# EAGLE design CMoy-Pro-V_1_0_0A-digi_pot (EAGLE 6.4)

## Sheet 1 of 2
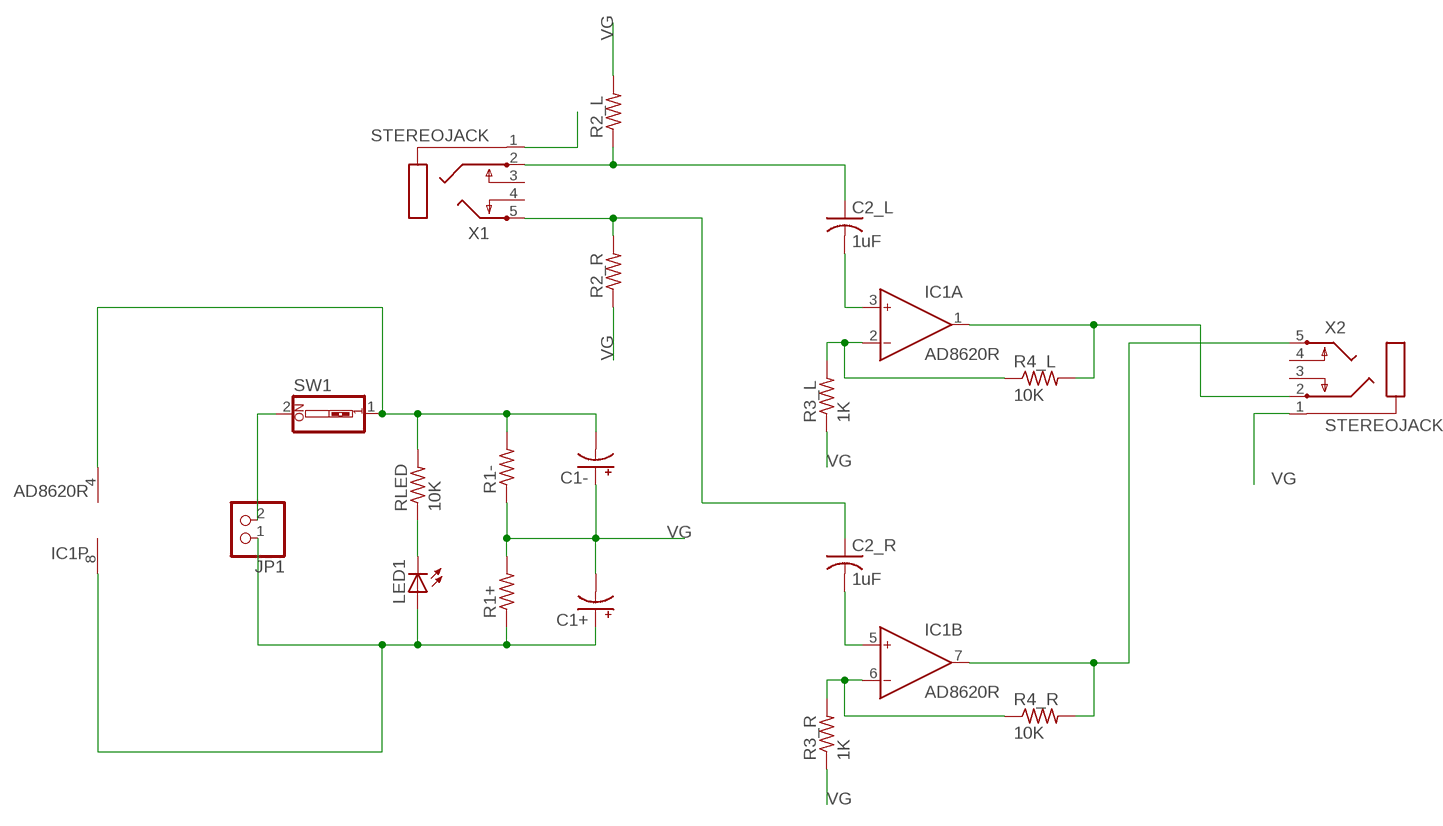
[diagram p0: schematic, sheet 1]

### Parts
C1+  CPOL-USE2.5-6  [E2,5-6]
C1-  CPOL-USE2.5-6  [E2,5-6]
C2_L  1uF  C-US102-043X133  [C102-043X133]
C2_R  1uF  C-US102-043X133  [C102-043X133]
IC1  AD8620R  [SO8]
JP1  PINHD-1X2  [1X02]
LED1  LEDCHIPLED_0805  [CHIPLED_0805]
R1+  R-US_R0805  [R0805]
R1-  R-US_R0805  [R0805]
R2_L  R-US_R0805  [R0805]
R2_R  R-US_R0805  [R0805]
R3_L  1K  R-US_R0805  [R0805]
R3_R  1K  R-US_R0805  [R0805]
R4_L  10K  R-US_R0805  [R0805]
R4_R  10K  R-US_R0805  [R0805]
RLED  10K  R-US_R0805  [R0805]
SW1  SW_DIP-1  [EDG-01]
X1  STEREOJACK  [STX3100]
X2  STEREOJACK  [STX3100]

### Nets
IN_L: C2_L.1 R2_L.1 X1.2
IN_R: C2_R.1 R2_R.2 X1.5
N$1: C2_L.2 IC1.3(A:IN+)
N$2: C2_R.2 IC1.5(B:IN+)
N$3: LED1.C RLED.1
N$5: IC1.2(A:IN-) R3_L.2 R4_L.1
N$6: IC1.6(B:IN-) R3_R.2 R4_R.1
OUT_L: IC1.1(A:OUT) R4_L.2 X2.2
OUT_R: IC1.7(B:OUT) R4_R.2 X2.5
V+: C1+.+ IC1.8(P:V+) JP1.1 LED1.A R1+.1
V-: JP1.2 SW1.2
V-_ON: C1-.- IC1.4(P:V-) R1-.2 RLED.2 SW1.1
VG: C1+.- C1-.+ R1+.2 R1-.1 R2_L.2 R2_R.1 R3_L.1 R3_R.1 X1.1 X2.1
Unconnected: X1.3 X1.4 X2.3 X2.4

## Sheet 2 of 2
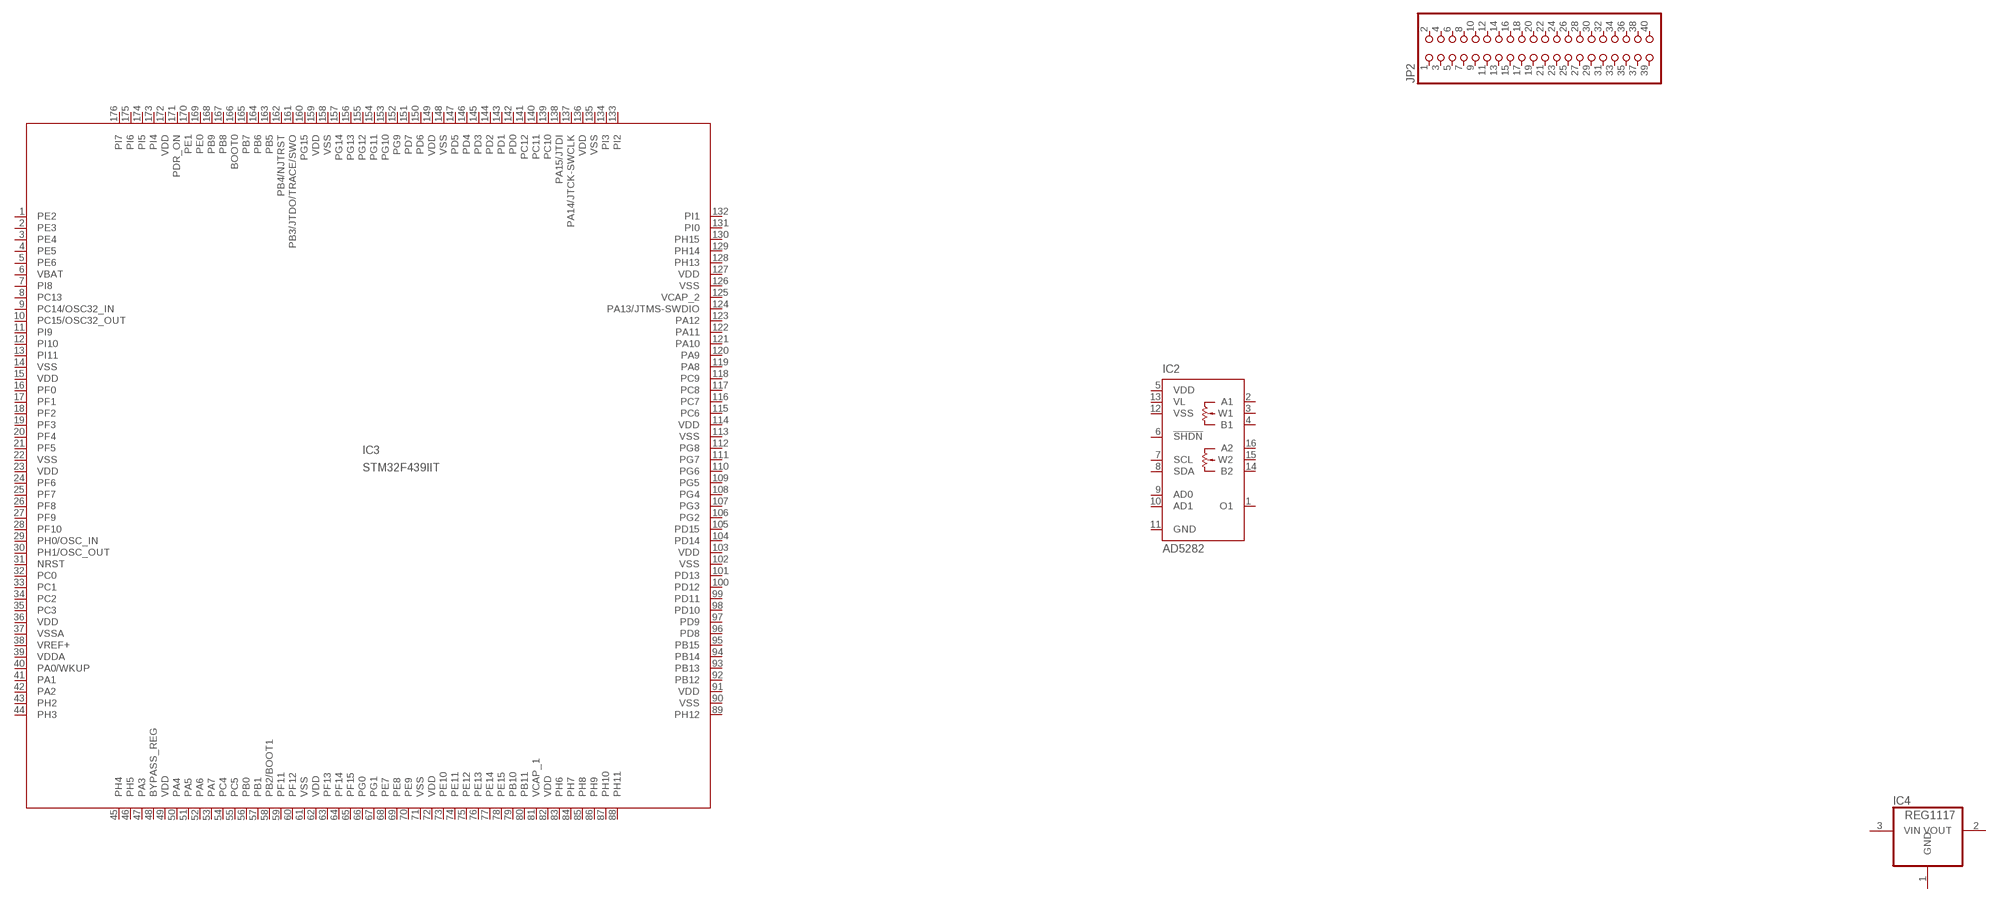
[diagram p1: schematic, sheet 2]

### Parts
IC2  AD5282  [TSSOP16]
IC3  STM32F439IIT  [LQFP-176]
IC4  REG1117  [SOT223]
JP2  PINHD-2X20  [2X20]
Unconnected: IC2.1(O1) IC2.2(A1) IC2.3(W1) IC2.4(B1) IC2.6(!SHDN) IC2.7(SCL) IC2.8(SDA) IC2.9(AD0) IC2.10(AD1) IC2.14(B2) IC2.15(W2) IC2.16(A2) IC3.1(PE2) IC3.2(PE3) IC3.3(PE4) IC3.4(PE5) IC3.5(PE6) IC3.7(PI8) IC3.8(PC13) IC3.9(PC14/OSC32_IN) IC3.10(PC15/OSC32_OUT) IC3.11(PI9) IC3.12(PI10) IC3.13(PI11) IC3.16(PF0) IC3.17(PF1) IC3.18(PF2) IC3.19(PF3) IC3.20(PF4) IC3.21(PF5) IC3.24(PF6) IC3.25(PF7) IC3.26(PF8) IC3.27(PF9) IC3.28(PF10) IC3.29(PH0/OSC_IN) IC3.30(PH1/OSC_OUT) IC3.31(NRST) IC3.32(PC0) IC3.33(PC1) IC3.34(PC2) IC3.35(PC3) IC3.40(PA0/WKUP) IC3.41(PA1) IC3.42(PA2) IC3.43(PH2) IC3.44(PH3) IC3.45(PH4) IC3.46(PH5) IC3.47(PA3) IC3.48(BYPASS_REG) IC3.50(PA4) IC3.51(PA5) IC3.52(PA6) IC3.53(PA7) IC3.54(PC4) IC3.55(PC5) IC3.56(PB0) IC3.57(PB1) IC3.58(PB2/BOOT1) IC3.59(PF11) IC3.60(PF12) IC3.62(VDD) IC3.63(PF13) IC3.64(PF14) IC3.65(PF15) IC3.66(PG0) IC3.67(PG1) IC3.68(PE7) IC3.69(PE8) IC3.70(PE9) IC3.73(PE10) IC3.74(PE11) IC3.75(PE12) IC3.76(PE13) IC3.77(PE14) IC3.78(PE15) IC3.79(PB10) IC3.80(PB11) IC3.83(PH6) IC3.84(PH7) IC3.85(PH8) IC3.86(PH9) IC3.87(PH10) IC3.88(PH11) IC3.89(PH12) IC3.92(PB12) IC3.93(PB13) IC3.94(PB14) IC3.95(PB15) IC3.96(PD8) IC3.97(PD9) IC3.98(PD10) IC3.99(PD11) IC3.100(PD12) IC3.101(PD13) IC3.104(PD14) IC3.105(PD15) IC3.106(PG2) IC3.107(PG3) IC3.108(PG4) IC3.109(PG5) IC3.110(PG6) IC3.111(PG7) IC3.112(PG8) IC3.115(PC6) IC3.116(PC7) IC3.117(PC8) IC3.118(PC9) IC3.119(PA8) IC3.120(PA9) IC3.121(PA10) IC3.122(PA11) IC3.123(PA12) IC3.124(PA13/JTMS-SWDIO) IC3.128(PH13) IC3.129(PH14) IC3.130(PH15) IC3.131(PI0) IC3.132(PI1) IC3.133(PI2) IC3.134(PI3) IC3.137(PA14/JTCK-SWCLK) IC3.138(PA15/JTDI) IC3.139(PC10) IC3.140(PC11) IC3.141(PC12) IC3.142(PD0) IC3.143(PD1) IC3.144(PD2) IC3.145(PD3) IC3.146(PD4) IC3.147(PD5) IC3.150(PD6) IC3.151(PD7) IC3.152(PG9) IC3.153(PG10) IC3.154(PG11) IC3.155(PG12) IC3.156(PG13) IC3.157(PG14) IC3.160(PG15) IC3.161(PB3/JTDO/TRACE/SWO) IC3.162(PB4/NJTRST) IC3.163(PB5) IC3.164(PB6) IC3.165(PB7) IC3.166(BOOT0) IC3.167(PB8) IC3.168(PB9) IC3.169(PE0) IC3.170(PE1) IC3.173(PI4) IC3.174(PI5) IC3.175(PI6) IC3.176(PI7) IC4.2(VOUT) IC4.3(VIN) JP2.1 JP2.2 JP2.3 JP2.4 JP2.5 JP2.6 JP2.7 JP2.8 JP2.9 JP2.10 JP2.11 JP2.12 JP2.13 JP2.14 JP2.15 JP2.16 JP2.17 JP2.18 JP2.19 JP2.20 JP2.21 JP2.22 JP2.23 JP2.24 JP2.25 JP2.26 JP2.27 JP2.28 JP2.29 JP2.30 JP2.31 JP2.32 JP2.33 JP2.34 JP2.35 JP2.36 JP2.37 JP2.38 JP2.39 JP2.40

## Power pins joined to a net without a drawn wire
GND: IC2.11(GND) IC4.1(GND)
PDR_ON: IC3.171(PDR_ON)
VBAT: IC3.6(VBAT)
VCAP_1: IC3.81(VCAP_1)
VCAP_2: IC3.125(VCAP_2)
VDD: IC2.5(VDD) IC3.15(VDD) IC3.23(VDD) IC3.36(VDD) IC3.49(VDD) IC3.72(VDD) IC3.82(VDD) IC3.91(VDD) IC3.103(VDD) IC3.114(VDD) IC3.127(VDD) IC3.136(VDD) IC3.149(VDD) IC3.159(VDD) IC3.172(VDD)
VDDA: IC3.39(VDDA)
VL: IC2.13(VL)
VREF+: IC3.38(VREF+)
VSS: IC2.12(VSS) IC3.14(VSS) IC3.22(VSS) IC3.61(VSS) IC3.71(VSS) IC3.90(VSS) IC3.102(VSS) IC3.113(VSS) IC3.126(VSS) IC3.135(VSS) IC3.148(VSS) IC3.158(VSS)
VSSA: IC3.37(VSSA)

## Library data of the parts
C1+ C1- = rcl:CPOL-US: POLARIZED CAPACITOR, American symbol
C2_L C2_R = rcl:C-US: CAPACITOR, American symbol
IC1 = analog-devices:AD8620: Precision, Very Low Noise, Low Input Bias Current, Wide Bandwidth JFET Operational Amplifiers Source: http://www.analog.com/static/imported-files/data_sheets/AD8610_8620.pdf; MF: ALTERA CORPORATION; MPN: AD8620ARZ; OC_FARNELL: 9994386; OC_NEWARK: 59K6972
IC2 = analog-devices:AD5282: Dual +15 V/±5 V, 256-Position, I2C-Compatible Digital Potentiometer Source: http://www.analog.com/static/imported-files/data_sheets/AD5280_5282.pdf; MF: ALTERA CORPORATION; MPN: AD5282BRUZ50; OC_FARNELL: 1438442; OC_NEWARK: 59K3850
IC3 = STM32F439IIT:STM32F439IIT: edit this description Auto generated by make-symbol-device-package-bsdl.ulp Rev. 43 Source:
IC4 = burr-brown:REG1117: 800mA and 1A Low Dropout (LDO) Positive Regulator 1.8V, 2.5V, 2.85V, 3.3V, 5V, and Adj; MPN: REG1117; OC_FARNELL: 1097566; OC_NEWARK: 14P6981
JP1 = pinhead:PINHD-1X2: PIN HEADER
JP2 = pinhead:PINHD-2X20: PIN HEADER
LED1 = adafruit:LED: LED OSRAM: - CHIPLED LG R971, LG N971, LY N971, LG Q971, LY Q971, LO R971, LY R971 LH N974, LH R974 LS Q976, LO Q976, LY Q976 LO Q996 - Hyper CHIPLED LW Q18S LB Q993, LB Q99A, LB R99A - SideLED LS A670, LO A670, LY A670, LG A670, LP A670 LB A673, LV A673, LT A673, LW A673 LH A674 LY A675 LS A676, LA A676, LO A676, LY A676, LW A676 LS A679, LY A679, LG A679 - Hyper Micro SIDELED® LS Y876, LA Y876, LO Y876, LY Y876 LT Y87S - SmartLED LW L88C, LW L88S LB L89C, LB L89S, LG L890 LS L89K, LO L89K, LY L89K LS L896, LA L896, LO L896, LY L896 - TOPLED LS T670, LO T670, LY T670, LG T670, LP T670 LSG T670, LSP T670, LSY T670, LOP T670, LYG T670 LG T671, LOG T671, LSG T671 LB T673, LV T673, LT T673, LW T673 LH T674 LS T676, LA T676, LO T676, LY T676, LB T676, LH T676, LSB T676, LW T676 LB T67C, LV T67C, LT T67C, LS T67K, LO T67K, LY T67K, LW E67C LS E67B, LA E67B, LO E67B, LY E67B, LB E67C, LV E67C, LT E67C LW T67C LS T679, LY T679, LG T679 LS T770, LO T770, LY T770, LG T770, LP T770 LB T773, LV T773, LT T773, LW T773 LH T774 LS E675, LA E675, LY E675, LS T675 LS T776, LA T776, LO T776, LY T776, LB T776 LHGB T686 LT T68C, LB T68C - Hyper Mini TOPLED® LB M676 - Mini TOPLED Santana® LG M470 LS M47K, LO M47K, LY M47K Source: http://www.osram.convergy.de/
R1+ R1- R2_L R2_R R3_L R3_R R4_L R4_R RLED = rcl:R-US_: RESISTOR, American symbol
SW1 = special:SW_DIP-1: DIP SWITCH
X1 X2 = adafruit:STEREOJACK: MIC/HEADPHONE JACK Stereo jack with two switches. Kycon STX3100, CUI SJ1-3555NG and/or 4UCon 05544

## Board
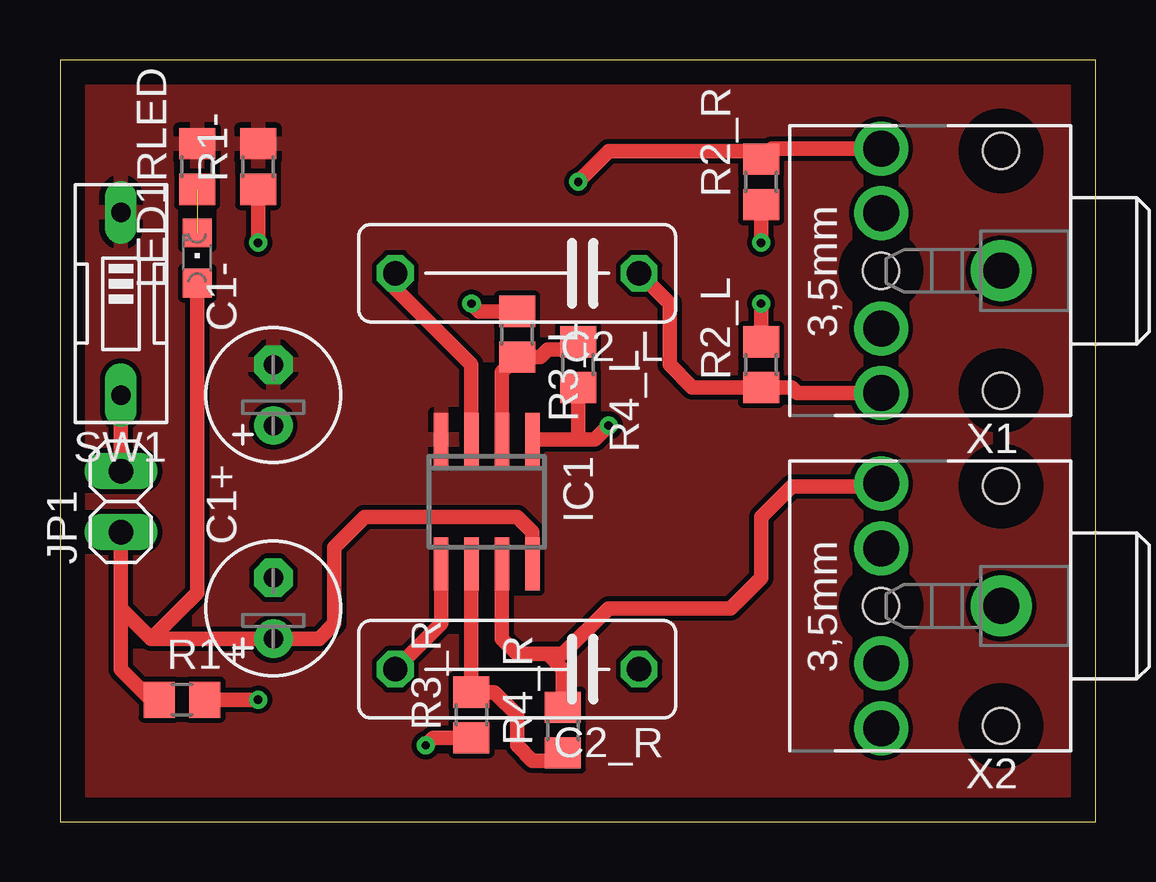
[diagram p2: board, top side]
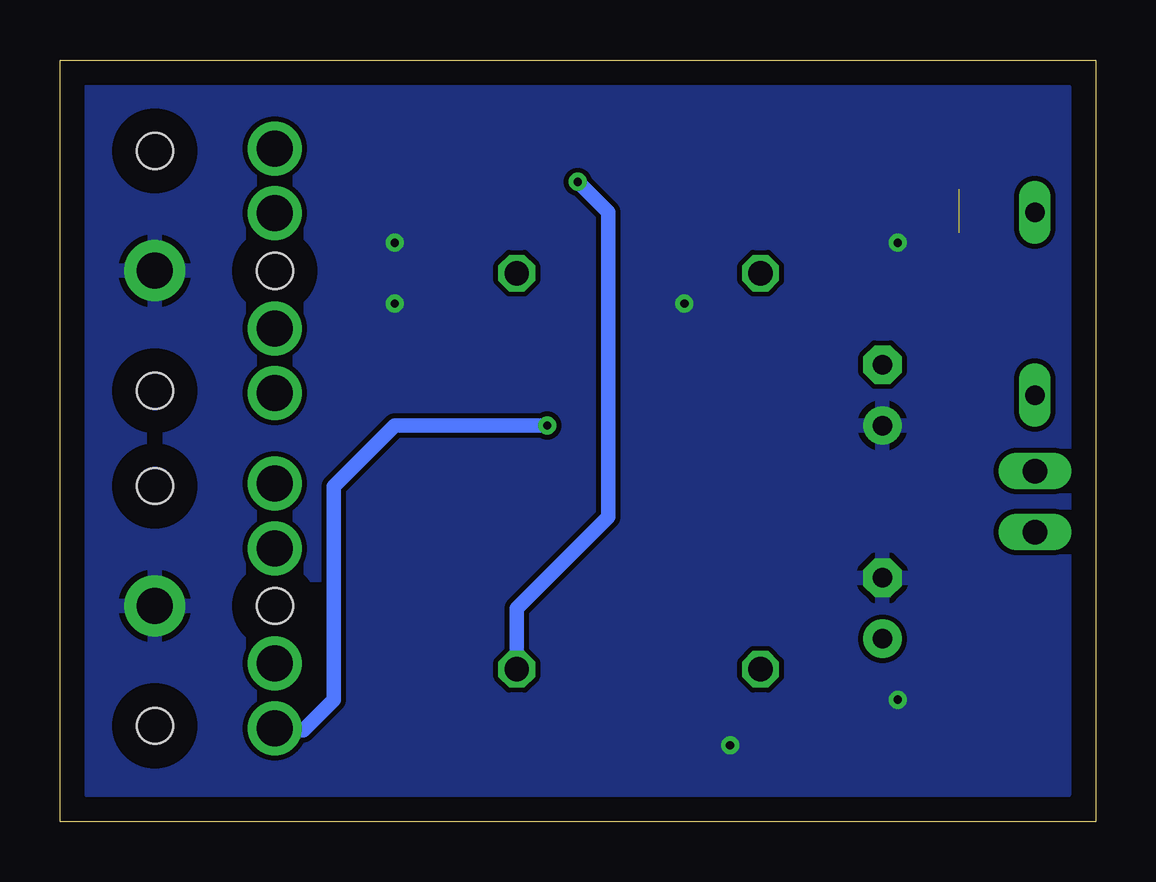
[diagram p3: board, bottom side, seen from below]

Size 43.16 x 31.75 mm. Coordinates in mm from the lower left corner, seen from the top.
Outline: 0,0 43.16,0 43.16,31.75 0,31.75 0,0
Copper layers (1*16): Top 0.035mm / dielectric 1.5mm / Bottom 0.035mm
Design rules "default": minimum track width 10mil, minimum drill 24mil, track to track 8mil, track to pad 8mil, pad to pad 8mil, via to via 8mil, smd to smd 8mil, copper to edge 40mil, drill to drill 8mil, minimum pad ring 10mil, minimum via ring 8mil, stop-mask expansion 4mil, vias tented up to drill 0mil, thermal gap 10mil

### Footprints (pad centres in the part's own frame; a part is rotated, then mirrored left to right if it is on the bottom)
E2,5-6 = drill 0.813 pad 1.6: + -1.27,0 | drill 0.813 pad 1.6 octagon: - 1.27,0
C102-043X133 = drill 1.016 octagon: 1 -5.08,0; 2 5.08,0
SO8 = smd 0.6 x 2.2: 1 -1.905,-2.6; 2 -0.635,-2.6; 3 0.635,-2.6; 4 1.905,-2.6; 5 1.905,2.6; 6 0.635,2.6; 7 -0.635,2.6; 8 -1.905,2.6
TSSOP16 = smd 0.9 x 0.35: 1 -2.875,2.275; 2 -2.875,1.625; 3 -2.875,0.975; 4 -2.875,0.325; 5 -2.875,-0.325; 6 -2.875,-0.975; 7 -2.875,-1.625; 8 -2.875,-2.275; 9 2.875,-2.275; 10 2.875,-1.625; 11 2.875,-0.975; 12 2.875,-0.325; 13 2.875,0.325; 14 2.875,0.975; 15 2.875,1.625; 16 2.875,2.275
LQFP-176 = smd 1.2 x 0.3: 1 -13.25,10.75; 2 -13.25,10.25; 3 -13.25,9.75; 4 -13.25,9.25; 5 -13.25,8.75; 6 -13.25,8.25; 7 -13.25,7.75; 8 -13.25,7.25; 9 -13.25,6.75; 10 -13.25,6.25; 11 -13.25,5.75; 12 -13.25,5.25; 13 -13.25,4.75; 14 -13.25,4.25; 15 -13.25,3.75; 16 -13.25,3.25; 17 -13.25,2.75; 18 -13.25,2.25; 19 -13.25,1.75; 20 -13.25,1.25; 21 -13.25,0.75; 22 -13.25,0.25; 23 -13.25,-0.25; 24 -13.25,-0.75; 25 -13.25,-1.25; 26 -13.25,-1.75; 27 -13.25,-2.25; 28 -13.25,-2.75; 29 -13.25,-3.25; 30 -13.25,-3.75; 31 -13.25,-4.25; 32 -13.25,-4.75; 33 -13.25,-5.25; 34 -13.25,-5.75; 35 -13.25,-6.25; 36 -13.25,-6.75; 37 -13.25,-7.25; 38 -13.25,-7.75; 39 -13.25,-8.25; 40 -13.25,-8.75; 41 -13.25,-9.25; 42 -13.25,-9.75; 43 -13.25,-10.25; 44 -13.25,-10.75; 89 13.25,-10.75; 90 13.25,-10.25; 91 13.25,-9.75; 92 13.25,-9.25; 93 13.25,-8.75; 94 13.25,-8.25; 95 13.25,-7.75; 96 13.25,-7.25; 97 13.25,-6.75; 98 13.25,-6.25; 99 13.25,-5.75; 100 13.25,-5.25; 101 13.25,-4.75; 102 13.25,-4.25; 103 13.25,-3.75; 104 13.25,-3.25; 105 13.25,-2.75; 106 13.25,-2.25; 107 13.25,-1.75; 108 13.25,-1.25; 109 13.25,-0.75; 110 13.25,-0.25; 111 13.25,0.25; 112 13.25,0.75; 113 13.25,1.25; 114 13.25,1.75; 115 13.25,2.25; 116 13.25,2.75; 117 13.25,3.25; 118 13.25,3.75; 119 13.25,4.25; 120 13.25,4.75; 121 13.25,5.25; 122 13.25,5.75; 123 13.25,6.25; 124 13.25,6.75; 125 13.25,7.25; 126 13.25,7.75; 127 13.25,8.25; 128 13.25,8.75; 129 13.25,9.25; 130 13.25,9.75; 131 13.25,10.25; 132 13.25,10.75 | smd 0.3 x 1.2: 45 -10.75,-13.25; 46 -10.25,-13.25; 47 -9.75,-13.25; 48 -9.25,-13.25; 49 -8.75,-13.25; 50 -8.25,-13.25; 51 -7.75,-13.25; 52 -7.25,-13.25; 53 -6.75,-13.25; 54 -6.25,-13.25; 55 -5.75,-13.25; 56 -5.25,-13.25; 57 -4.75,-13.25; 58 -4.25,-13.25; 59 -3.75,-13.25; 60 -3.25,-13.25; 61 -2.75,-13.25; 62 -2.25,-13.25; 63 -1.75,-13.25; 64 -1.25,-13.25; 65 -0.75,-13.25; 66 -0.25,-13.25; 67 0.25,-13.25; 68 0.75,-13.25; 69 1.25,-13.25; 70 1.75,-13.25; 71 2.25,-13.25; 72 2.75,-13.25; 73 3.25,-13.25; 74 3.75,-13.25; 75 4.25,-13.25; 76 4.75,-13.25; 77 5.25,-13.25; 78 5.75,-13.25; 79 6.25,-13.25; 80 6.75,-13.25; 81 7.25,-13.25; 82 7.75,-13.25; 83 8.25,-13.25; 84 8.75,-13.25; 85 9.25,-13.25; 86 9.75,-13.25; 87 10.25,-13.25; 88 10.75,-13.25; 133 10.75,13.25; 134 10.25,13.25; 135 9.75,13.25; 136 9.25,13.25; 137 8.75,13.25; 138 8.25,13.25; 139 7.75,13.25; 140 7.25,13.25; 141 6.75,13.25; 142 6.25,13.25; 143 5.75,13.25; 144 5.25,13.25; 145 4.75,13.25; 146 4.25,13.25; 147 3.75,13.25; 148 3.25,13.25; 149 2.75,13.25; 150 2.25,13.25; 151 1.75,13.25; 152 1.25,13.25; 153 0.75,13.25; 154 0.25,13.25; 155 -0.25,13.25; 156 -0.75,13.25; 157 -1.25,13.25; 158 -1.75,13.25; 159 -2.25,13.25; 160 -2.75,13.25; 161 -3.25,13.25; 162 -3.75,13.25; 163 -4.25,13.25; 164 -4.75,13.25; 165 -5.25,13.25; 166 -5.75,13.25; 167 -6.25,13.25; 168 -6.75,13.25; 169 -7.25,13.25; 170 -7.75,13.25; 171 -8.25,13.25; 172 -8.75,13.25; 173 -9.25,13.25; 174 -9.75,13.25; 175 -10.25,13.25; 176 -10.75,13.25
SOT223 = smd 1.499 x 2.007: 1 -2.261,-3.15; 2 0.025,-3.15; 3 2.311,-3.15 | smd 3.81 x 2.007: 4 0,3.15
1X02 = drill 1.016 long: 1 -1.27,0; 2 1.27,0
2X20 = drill 1.016 octagon: 1 -24.13,-1.27; 2 -24.13,1.27; 3 -21.59,-1.27; 4 -21.59,1.27; 5 -19.05,-1.27; 6 -19.05,1.27; 7 -16.51,-1.27; 8 -16.51,1.27; 9 -13.97,-1.27; 10 -13.97,1.27; 11 -11.43,-1.27; 12 -11.43,1.27; 13 -8.89,-1.27; 14 -8.89,1.27; 15 -6.35,-1.27; 16 -6.35,1.27; 17 -3.81,-1.27; 18 -3.81,1.27; 19 -1.27,-1.27; 20 -1.27,1.27; 21 1.27,-1.27; 22 1.27,1.27; 23 3.81,-1.27; 24 3.81,1.27; 25 6.35,-1.27; 26 6.35,1.27; 27 8.89,-1.27; 28 8.89,1.27; 29 11.43,-1.27; 30 11.43,1.27; 31 13.97,-1.27; 32 13.97,1.27; 33 16.51,-1.27; 34 16.51,1.27; 35 19.05,-1.27; 36 19.05,1.27; 37 21.59,-1.27; 38 21.59,1.27; 39 24.13,-1.27; 40 24.13,1.27
CHIPLED_0805 = smd 1.2 x 1.2: A 0,-1.05; C 0,1.05
R0805 = smd 1.3 x 1.5: 1 -0.95,0; 2 0.95,0
EDG-01 = drill 0.813 long: 1 0,-3.81; 2 0,3.81
STX3100 = drill 1.5 pad 2.54: 1 2.7,-0.1 | drill 1.5: 2 7.7,5; 3 7.7,2.3; 4 7.7,-2.5; 5 7.7,-5.2 | hole 1.5: 2.7,4.9; 2.7,-5.1; 7.7,-0.1

### Placement (x,y rotation side)
C1+  8.89,8.89 90 top
C1-  8.89,17.78 90 top
C2_L  19.05,22.86 180 top
C2_R  19.05,6.35 180 top
IC1  17.78,13.34 180 top
IC2  -10.16,1.27 0 top  (outside the outline)
IC3  -31.75,16.51 0 top  (outside the outline)
IC4  -46.99,-6.35 0 top  (outside the outline)
JP1  2.54,13.34 90 top
JP2  -15.24,-10.16 0 top  (outside the outline)
LED1  5.71,23.49 0 top
R1+  5.08,5.08 0 top
R1-  8.26,27.3 90 top
R2_L  29.21,19.05 90 top
R2_R  29.21,26.67 90 top
R3_L  19.05,20.32 270 top
R3_R  17.14,4.45 90 top
R4_L  21.59,19.05 270 top
R4_R  20.95,3.81 90 top
RLED  5.71,27.3 90 top
SW1  2.54,21.59 180 top
X1  41.91,22.86 180 top
X2  41.91,8.89 180 top

### Tracks (layer width: path | path; a pad name or v marks a point on that pad's centre or on a via)
GND  (1 unrouted)
IN_L
  Top 0.61: X1.2 30.72,17.86 30.48,18.1 R2_L.1 26.35,18.1 25.4,19.05 25.4,21.59 C2_L.1
IN_R  (via drill 0.35)
  Top 0.61: X1.5 29.65,28.06 R2_R.2 28.89,27.94 22.86,27.94 v21.59,26.67
  Bottom 0.61: C2_R.1 24.13,8.89 20.32,12.7 20.32,25.4 v21.59,26.67
N$1
  Top 0.61: IC1.3 17.14,19.05 13.97,22.23 C2_L.2
N$2
  Top 0.61: IC1.5 15.88,8.26 C2_R.2
N$3  (1 unrouted)
N$5
  Top 0.61: IC1.2 18.41,18.74 R3_L.2 20,19.37 20.32,19.68 21.27,19.68 R4_L.1
N$6
  Top 0.61: IC1.6 R3_R.2 18.1,5.4 19.05,4.45 19.05,3.18 19.68,2.54 20.64,2.54 R4_R.1
OUT_L  (via drill 0.35)
  Top 0.61: IC1.1 21.59,15.93 | 21.59,15.93 22.29,15.93 v22.86,16.51 | R4_L.2 21.59,15.93
  Bottom 0.61: v22.86,16.51 29.21,16.51 31.75,13.97 31.75,5.08 33.02,3.81 34.13,3.81 X2.2
OUT_R
  Top 0.61: IC1.7 18.41,7.62 19.05,6.99 20.32,6.99 | 20.32,6.99 20.95,6.99 22.86,8.89 27.94,8.89 29.21,10.16 29.21,12.7 30.48,13.97 34.09,13.97 X2.5 | R4_R.2 20.95,6.35 20.32,6.99
V+
  Top 0.61: JP1.1 2.54,8.89 | 2.54,8.89 3.81,7.62 | 3.81,7.62 C1+.+ 10.79,7.62 11.43,8.26 11.43,11.43 12.7,12.7 19.05,12.7 19.68,12.07 IC1.8 | LED1.A 5.71,9.52 3.81,7.62 | R1+.1 3.81,5.08 2.54,6.35 2.54,8.89
V-
  Top 0.61: JP1.2 SW1.2
V-_ON
  pour Top: 1.27,30.48 41.91,30.48 41.91,1.27 1.27,1.27
VDD  (14 unrouted)
VG  (via drill 0.35)
  Top 0.61: R1-.1 v8.26,24.13 | R1+.2 v8.26,5.08 | R2_L.2 v29.21,21.59 | R2_R.1 v29.21,24.13 | R3_L.1 17.46,21.27 v17.14,21.59 | R3_R.1 15.56,3.5 v15.24,3.18
  pour Bottom: 1.27,30.48 41.91,30.48 41.91,1.27 1.27,1.27
VSS  (11 unrouted)